# Altium schematic sheet power_unit.SchDoc
size A3
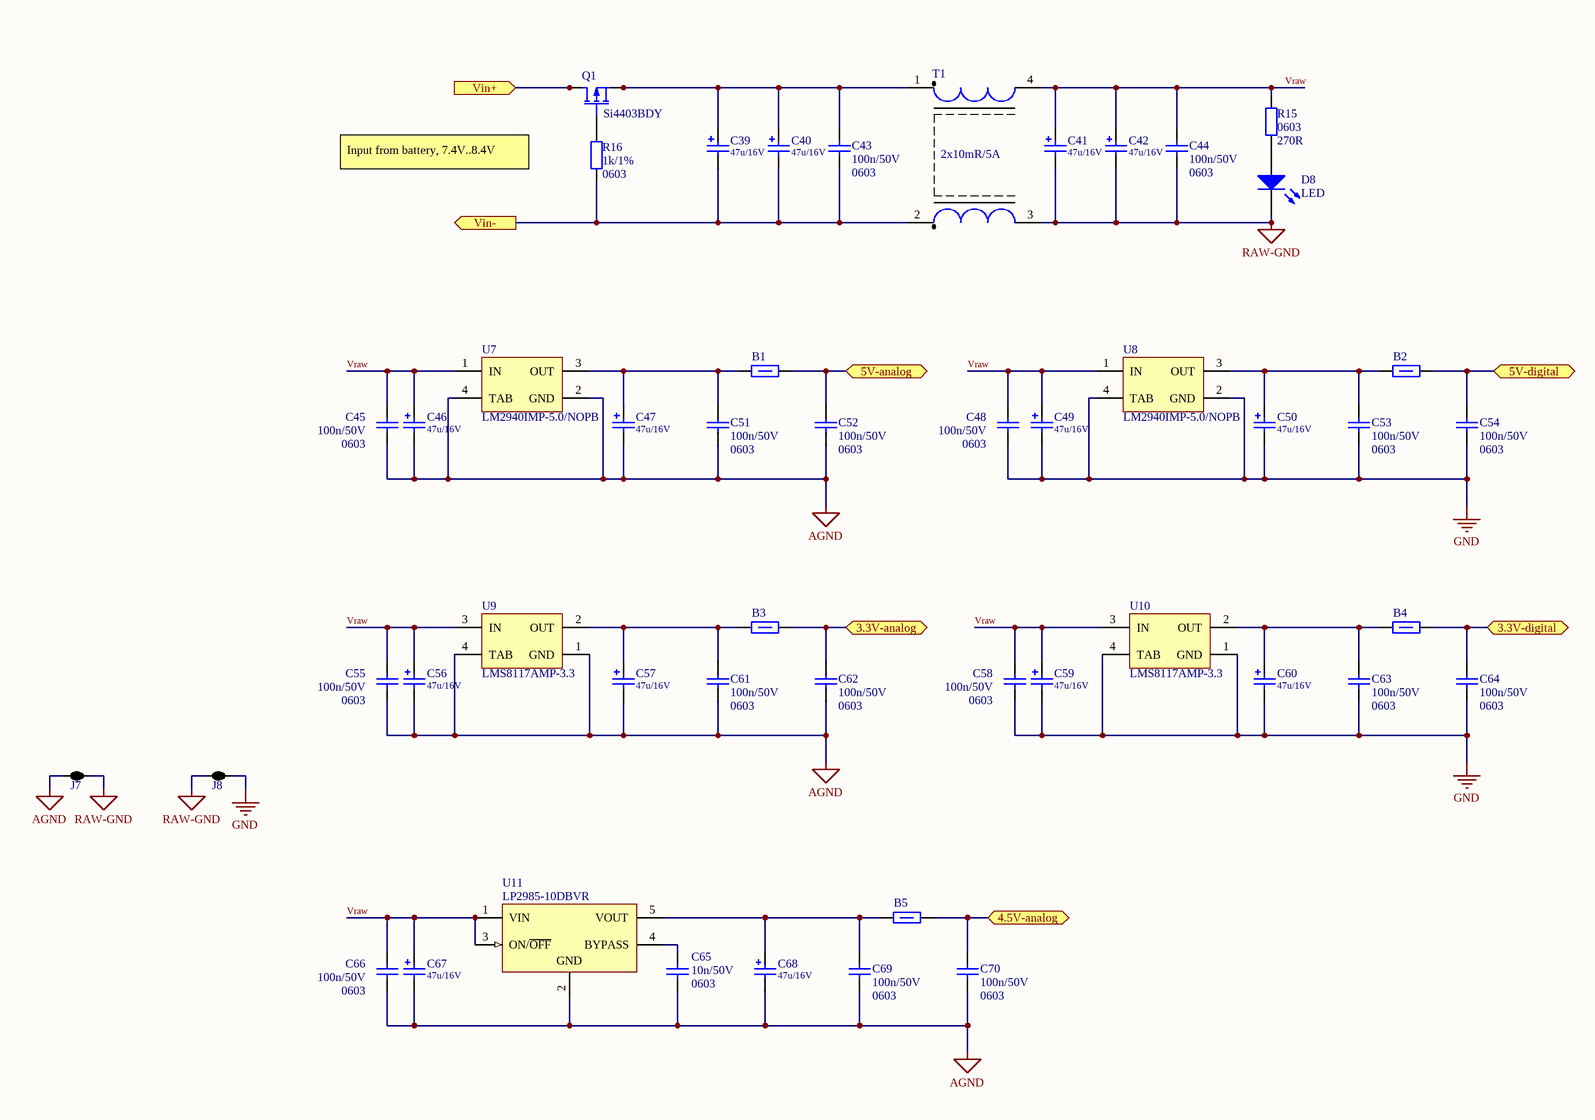
[diagram p0: power_unit.SchDoc]

## Parts
B1  120R/100MHz  [SMD_FerriteBead_1206]  (value not drawn)
B2  120R/100MHz  [SMD_FerriteBead_1206]  (value not drawn)
B3  120R/100MHz  [SMD_FerriteBead_1206]  (value not drawn)
B4  120R/100MHz  [SMD_FerriteBead_1206]  (value not drawn)
B5  120R/100MHz  [SMD_FerriteBead_1206]  (value not drawn)
C39  47u/16V  [Tantalum_cap_B]
C40  47u/16V  [Tantalum_cap_B]
C41  47u/16V  [Tantalum_cap_B]
C42  47u/16V  [Tantalum_cap_B]
C43  Package: 0603  [SMD_Capacitor_0603]  (hidden comment: 100n/50V)
C44  Package: 0603  [SMD_Capacitor_0603]  (hidden comment: 100n/50V)
C45  Package: 0603  [SMD_Capacitor_0603]  (hidden comment: 100n/50V)
C46  47u/16V  [Tantalum_cap_B]
C47  47u/16V  [Tantalum_cap_B]
C48  Package: 0603  [SMD_Capacitor_0603]  (hidden comment: 100n/50V)
C49  47u/16V  [Tantalum_cap_B]
C50  47u/16V  [Tantalum_cap_B]
C51  Package: 0603  [SMD_Capacitor_0603]  (hidden comment: 100n/50V)
C52  Package: 0603  [SMD_Capacitor_0603]  (hidden comment: 100n/50V)
C53  Package: 0603  [SMD_Capacitor_0603]  (hidden comment: 100n/50V)
C54  Package: 0603  [SMD_Capacitor_0603]  (hidden comment: 100n/50V)
C55  Package: 0603  [SMD_Capacitor_0603]  (hidden comment: 100n/50V)
C56  47u/16V  [Tantalum_cap_B]
C57  47u/16V  [Tantalum_cap_B]
C58  Package: 0603  [SMD_Capacitor_0603]  (hidden comment: 100n/50V)
C59  47u/16V  [Tantalum_cap_B]
C60  47u/16V  [Tantalum_cap_B]
C61  Package: 0603  [SMD_Capacitor_0603]  (hidden comment: 100n/50V)
C62  Package: 0603  [SMD_Capacitor_0603]  (hidden comment: 100n/50V)
C63  Package: 0603  [SMD_Capacitor_0603]  (hidden comment: 100n/50V)
C64  Package: 0603  [SMD_Capacitor_0603]  (hidden comment: 100n/50V)
C65  value 10n/50V  Package: 0603  [SMD_Capacitor_0603]  (hidden comment: Cap)
C66  Package: 0603  [SMD_Capacitor_0603]  (hidden comment: 100n/50V)
C67  47u/16V  [Tantalum_cap_B]
C68  47u/16V  [Tantalum_cap_B]
C69  Package: 0603  [SMD_Capacitor_0603]  (hidden comment: 100n/50V)
C70  Package: 0603  [SMD_Capacitor_0603]  (hidden comment: 100n/50V)
D8  LED  [LED 0805 RED]
J7  2 way net tie junction  [2way_MP]  (value not drawn)  (net tie, no BOM)
J8  2 way net tie junction  [2way_MP]  (value not drawn)  (net tie, no BOM)
Q1  Si4403BDY  [SOIC-8_M]
R15  0603  value 270R  [SMD_Resistor_0603]
R16  Package: 0603  [SMD_Resistor_0603]  (hidden comment: 1k/1%)
T1  2x10mR/5A  [TDK_ACM7060]
U7  LM2940IMP-5.0/NOPB  [MP04A_N]
U8  LM2940IMP-5.0/NOPB  [MP04A_N]
U9  LMS8117AMP-3.3  [MP04A_M]
U10  LMS8117AMP-3.3  [MP04A_M]
U11  LP2985-10DBVR  [TI-DBV5_N]

## Ports
3.3V-analog, 3.3V-digital, 4.5V-analog, 5V-analog, 5V-digital, Vin+ (in), Vin- (out)

## Nets
AGND: C45.2 C46.2 C47.2 C51.2 C52.2 C55.2 C56.2 C57.2 C61.2 C62.2 C65.2 C66.2 C67.2 C68.2 C69.2 C70.2 J7.2 U7.2(GND) U7.4(TAB) U9.1(GND) U9.4(TAB) U11.2(GND)
GND: C48.2 C49.2 C50.2 C53.2 C54.2 C58.2 C59.2 C60.2 C63.2 C64.2 J8.1 U8.2(GND) U8.4(TAB) U10.1(GND) U10.4(TAB)
RAW-GND: C41.2 C42.2 C44.2 D8.2(K) J7.1 J8.2 T1.3
3.3V-analog: B3.2 C62.1 ; port 3.3V-analog
3.3V-digital: B4.2 C64.1 ; port 3.3V-digital
4.5V-analog: B5.2 C70.1 ; port 4.5V-analog
5V-analog: B1.2 C52.1 ; port 5V-analog
5V-digital: B2.2 C54.1 ; port 5V-digital
Vin+: Q1.5(D) Q1.6(D) Q1.7(D) Q1.8(D) ; port Vin+
Vin-: C39.2 C40.2 C43.2 R16.2 T1.2 ; port Vin-
Vraw: C41.1 C42.1 C44.1 C45.1 C46.1 C48.1 C49.1 C55.1 C56.1 C58.1 C59.1 C66.1 C67.1 R15.1 T1.4 U7.1(IN) U8.1(IN) U9.3(IN) U10.3(IN) U11.1(VIN) U11.3(ON/~{OFF})
NetB1_1: B1.1 C47.1 C51.1 U7.3(OUT)
NetB2_1: B2.1 C50.1 C53.1 U8.3(OUT)
NetB3_1: B3.1 C57.1 C61.1 U9.2(OUT)
NetB4_1: B4.1 C60.1 C63.1 U10.2(OUT)
NetB5_1: B5.1 C68.1 C69.1 U11.5(VOUT)
NetC39_1: C39.1 C40.1 C43.1 Q1.1(S) Q1.2(S) Q1.3(S) T1.1
NetC65_1: C65.1 U11.4(BYPASS)
NetD8_1: D8.1(A) R15.2
NetQ1_4: Q1.4(G) R16.1

## Notes on the sheet
- Input from battery, 7.4V..8.4V
- Title:
- Sheet:
- of
- Author:
- Model:
- Document Number:
- Checked by:
- Iss-Rev:
- Approved by:
- Date:
- File name:

## Library data of the parts
B1-B5 = BLM31PG121SH1L: Ferrite bead, 1206, 0.02HM, 3.5A.; Manufacturer: Murata; Current Rating: 3.5A; Series Resistance DC: 0.02R; Package: 1206; Value: 120R/100MHz; ManufacturerPartNumber: BLM31PG121SH1L
C39-C42 C46 C47 C49 C50 C56 C57 C59 C60 C67 C68 = Cap Tantalum: Tantalum Capacitor; Value: 47u/16V
C43-C45 C48 C51-C55 C58 C61-C64 C66 C69 C70 = Cer_C0603T104K5RALTU: Ceramic Cap Kemet COTS 100n/50V X7R 0603; Manufacturer: Kemet; ManufacturerPartNumber: C0603T104K5RALTU; Value: 100n/50V
D8 = LED3: Typical BLUE SiC LED; Published: 8-Jun-2000; LatestRevisionDate: 17-Dec-2003; LatestRevisionNote: PCB Footprint replaced.; DatasheetVersion: 16-Apr-2002; PackageVersion: 16-Apr-2002; PackageReference: 3.5X2.8X1.9; Publisher: Altium Limited; PackageDescription: SM LED; 2 C-Bend Leads; Body 3.5 x 2.8 x 1.9 mm, inc leads (LxWxH typ)
J7 J8 = 2way: ComponentLink1URL: http://www.edatools.cz/addons; ComponentLink1Description: Source; FootprintNote: LP=12mil, MP=40mil, HP=120mil
Q1 = Si4403BDY: P-Channel 1.8 V (G-S) MOSFET; Manufacturer Part Number: Si4403BDY; value: Si4403BDY
R15 = Res2: Resistor; Published: 8-Jun-2000; LatestRevisionDate: 17-Jul-2002; LatestRevisionNote: Re-released for DXP Platform.; PackageReference: AXIAL-0.4; Publisher: Altium Limited; PackageDescription: Axial Device, Thru-Hole; 2 Leads; 0.4 in Pin Spacing
R16 = CRCW06031K00FKxxxx: 1k/1% Vishay CRCW 0603 Resistor. 100mW, 100ppm, 75V.; Manufacturer: Vishay; ManufacturerPartNumber: CRCW06031K00FKxxxx; Value: 1k/1%
T1 = ACM7060-301-2PL-TL01: TDK ACM7060-301 Common Mode Choke; Manufacturer: TDK; ManufacturerPartNumber: ACM7060-301-2PL-TL01; Value: 2x10mR/5A
U7 U8 = LM2940IMP-5.0/NOPB: 1A Low Dropout Regulator, 4-pin SOT-223, Pb-Free; Manufacturer: National Semiconductor; PackageTopMarking: XYTT*L53B; PowerWise: N; CompType: LDO IC; High-Reliability: Y; DatasheetVersion: Jan-2007; PackageVersion: revB, Apr-2003; PackageReference: MP04A; PackageDescription: Molded SOT-223, 6.50 x 3.56 x 1.6mm Body, 4 Lead, 2.3mm Pitch; PartNumber: LM2940IMP-5.0/NOPB; RoHS: Y; PinCount: 4; Code_JEDEC: TO-261-AA; Code_IPC: SOT223-4; ComponentLink1Description: Manufacturer URL; ComponentLink1URL: http://www.national.com/; ComponentLink2Description: LM2940 Datasheet; ComponentLink2URL: http://www.national.com/ds/LM/LM2940.pdf; ComponentLink3Description: LM2940 Web Page; ComponentLink3URL: http://www.national.com/pf/LM/LM2940.html; ComponentLink4Description: MP04A Package Page; ComponentLink4URL: http://www.national.com/packaging/folders/mp04a.html
U9 U10 = LMS8117AMP-3.3: 1A Low-Dropout Linear Regulator, 4-pin SOT-223; Manufacturer: National Semiconductor; PackageTopMarking: XYTT*LS01; PowerWise: N; CompType: LDO IC; High-Reliability: Y; DatasheetVersion: Apr-2005; PackageVersion: revB, Apr-2003; PackageReference: MP04A; PackageDescription: Molded SOT-223, 6.50 x 3.56 x 1.6mm Body, 4 Lead, 2.3mm Pitch; PartNumber: LMS8117AMP-3.3; RoHS: N; PinCount: 4; Code_JEDEC: TO-261-AA; Code_IPC: SOT223-4; ComponentLink1Description: Manufacturer URL; ComponentLink1URL: http://www.national.com/; ComponentLink2Description: LMS8117A Datasheet; ComponentLink2URL: http://www.national.com/ds/LM/LMS8117A.pdf; ComponentLink3Description: LMS8117A Web Page; ComponentLink3URL: http://www.national.com/pf/LM/LMS8117A.html; ComponentLink4Description: MP04A Package Page; ComponentLink4URL: http://www.national.com/packaging/folders/mp04a.html
U11 = LP2985-10DBVR: Single Output Low Noise LDO, 150 mA, Fixed 10 V Output, 2.2 to 16 V Input, with Low IQ, 5-pin SOT-23 (DBV), -40 to 125 degC, Green (RoHS & no Sb/Br); Manufacturer: Texas Instruments; Accuracy(%): 1.5; Fixed Output Options(V): 10; Iout(Max)(A): 0.15; Iq(Typ)(mA): 0.85; SubFamily: Single Channel LDO; Vdo(Typ)(mV): 280; Vin(Max)(V): 16; Vin(Min)(V): 2.2; DatasheetVersion: SLVS522N; PackageVersion: 4073253-4/K; PackageReference: DBV5; PackageDescription: 5-Pin Plastic Small Outline, Body 1.60 Ă— 2.90 mm, Pitch 0.95 mm; Supplier 1: Digi-Key; Supplier Part Number 1: 296-24263-2-ND; Supplier 2: Digi-Key; Supplier Part Number 2: 296-24263-1-ND; Supplier 3: Digi-Key; Supplier Part Number 3: 296-24263-6-ND; Supplier 4: Newark; Supplier Part Number 4: 24R9588; Supplier 5: Mouser; Supplier Part Number 5: 595-LP2985-10DBVR; Eco-Plan: Green (RoHS & no Sb/Br); Vout Adj(Max)(V): 10; Vout Adj(Min)(V): 10; Mounting Technology: Surface Mount; Code_JEDEC: MO-178; PartNumber: LP2985-10DBVR; ComponentLink1Description: Manufacturer URL; ComponentLink1URL: http://www.ti.com/; ComponentLink2Description: Datasheet; ComponentLink2URL: http://www.ti.com/general/docs/lit/getliterature.tsp?genericPartNumber=LP2985-10&fileType=pdf; ComponentLink3Description: Package Specification; ComponentLink3URL: http://www.ti.com/litv/pdf/mpds018i